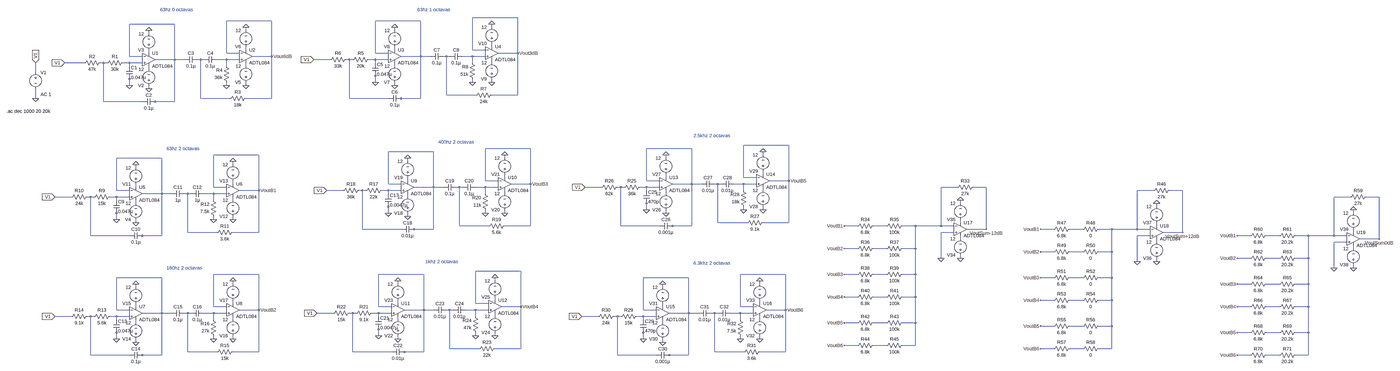
[diagram p0: schematic Ecualizador.asc, whole sheet]
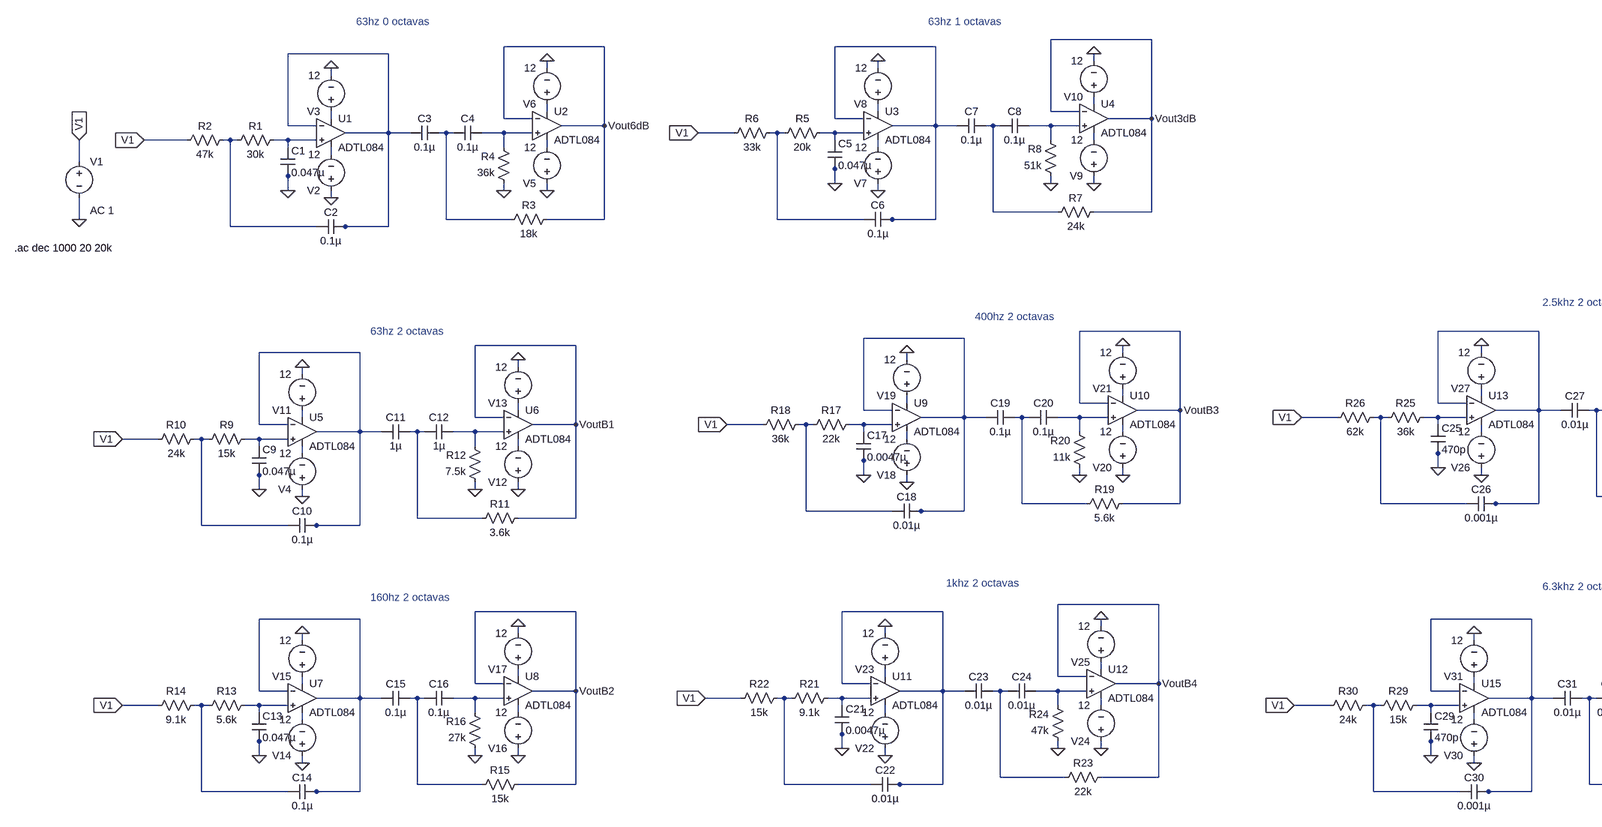
[diagram p1: schematic Ecualizador.asc, part, row 1 of 1, column 1 of 2]
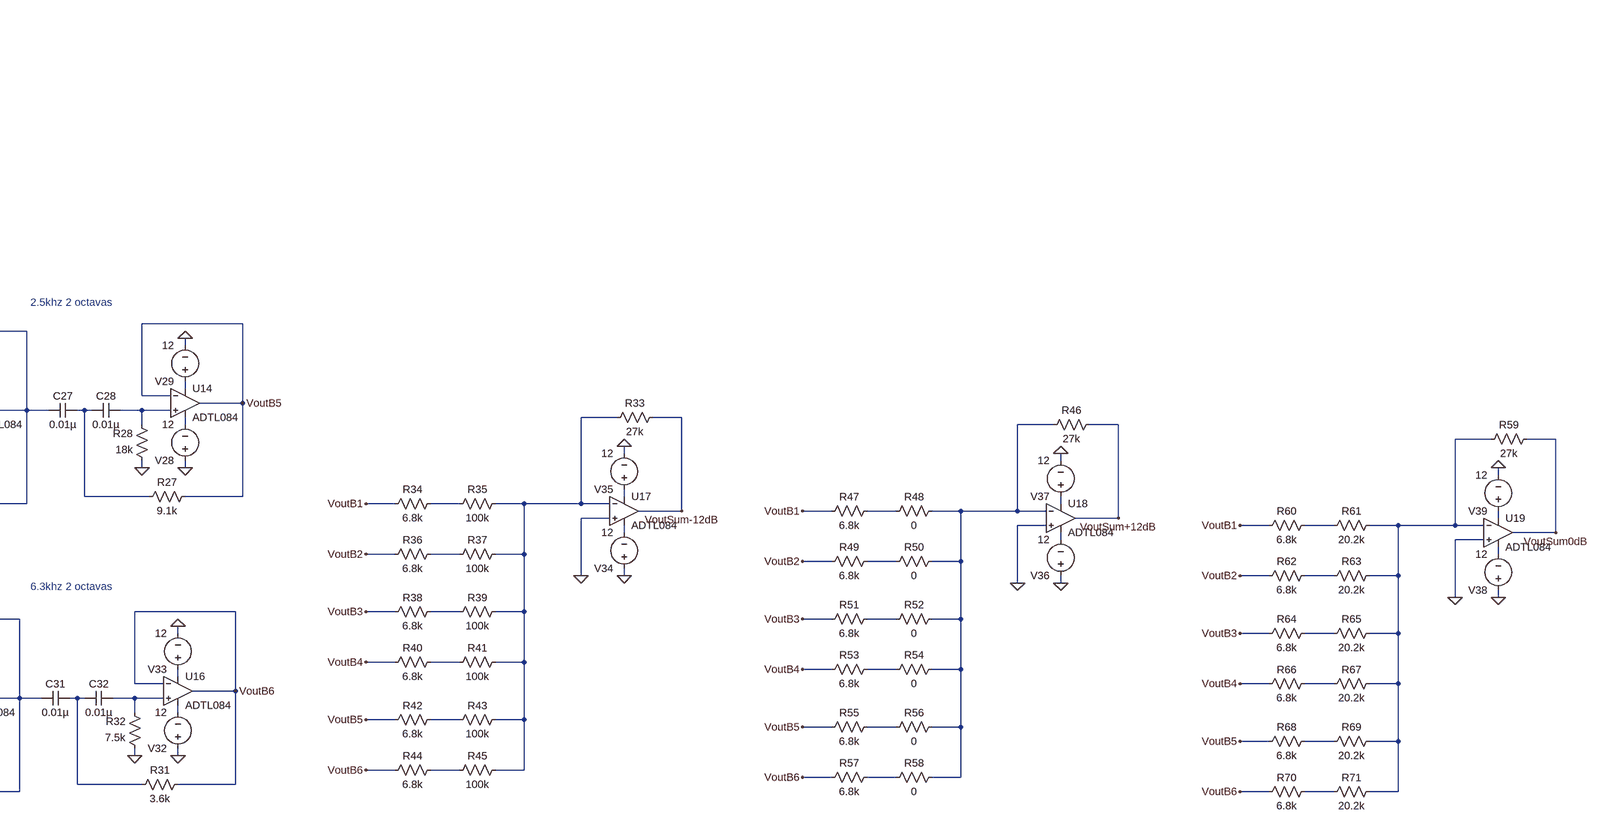
[diagram p2: schematic Ecualizador.asc, part, row 1 of 1, column 2 of 2]
Ecualizador.asc, the LTspice schematic file:
Version 4.1
SHEET 1 7452 4816
WIRE 1216 -80 992 -80
WIRE 0 -64 -224 -64
WIRE 736 -64 512 -64
WIRE -480 -48 -704 -48
WIRE 1088 -32 1088 -48
WIRE -128 -16 -128 -32
WIRE 608 -16 608 -32
WIRE -608 0 -608 -16
WIRE 1088 64 1088 48
WIRE -128 80 -128 64
WIRE 608 80 608 64
WIRE 992 80 992 -80
WIRE 1056 80 992 80
WIRE -608 96 -608 80
WIRE -224 96 -224 -64
WIRE -160 96 -224 96
WIRE 512 96 512 -64
WIRE 576 96 512 96
WIRE 1216 96 1216 -80
WIRE 1216 96 1120 96
WIRE -704 112 -704 -48
WIRE -640 112 -704 112
WIRE 0 112 0 -64
WIRE 0 112 -96 112
WIRE 736 112 736 -64
WIRE 736 112 640 112
WIRE 784 112 736 112
WIRE 864 112 848 112
WIRE 880 112 864 112
WIRE 992 112 944 112
WIRE 1056 112 992 112
WIRE -480 128 -480 -48
WIRE -480 128 -576 128
WIRE -432 128 -480 128
WIRE -352 128 -368 128
WIRE -336 128 -352 128
WIRE -224 128 -272 128
WIRE -160 128 -224 128
WIRE 288 128 208 128
WIRE 384 128 368 128
WIRE 400 128 384 128
WIRE 512 128 480 128
WIRE 576 128 512 128
WIRE -928 144 -1024 144
WIRE -832 144 -848 144
WIRE -816 144 -832 144
WIRE -704 144 -736 144
WIRE -640 144 -704 144
WIRE 512 144 512 128
WIRE 992 144 992 112
WIRE 1088 144 1088 128
WIRE -704 160 -704 144
WIRE -224 160 -224 128
WIRE -128 160 -128 144
WIRE 608 160 608 144
WIRE -608 176 -608 160
WIRE -1168 192 -1168 144
WIRE 512 208 512 192
WIRE -704 224 -704 208
WIRE 512 240 512 208
WIRE 992 240 992 224
WIRE 1088 240 1088 224
WIRE -704 256 -704 224
WIRE -224 256 -224 240
WIRE -128 256 -128 240
WIRE 608 256 608 240
WIRE -608 272 -608 256
WIRE 864 304 864 112
WIRE 1008 304 864 304
WIRE 1216 304 1216 96
WIRE 1216 304 1088 304
WIRE -1168 320 -1168 272
WIRE -352 320 -352 128
WIRE -208 320 -352 320
WIRE 0 320 0 112
WIRE 0 320 -128 320
WIRE 384 320 384 128
WIRE 576 320 384 320
WIRE 640 320 624 320
WIRE 736 320 736 112
WIRE 736 320 640 320
WIRE -832 336 -832 144
WIRE -640 336 -832 336
WIRE -576 336 -592 336
WIRE -480 336 -480 128
WIRE -480 336 -576 336
WIRE 2624 1344 2400 1344
WIRE 1280 1360 1056 1360
WIRE 2144 1360 1920 1360
WIRE 800 1376 576 1376
WIRE -64 1392 -288 1392
WIRE 2496 1392 2496 1376
WIRE -544 1408 -768 1408
WIRE 1152 1408 1152 1392
WIRE 2016 1408 2016 1392
WIRE 672 1424 672 1408
WIRE -192 1440 -192 1424
WIRE -672 1456 -672 1440
WIRE 2496 1488 2496 1472
WIRE 1152 1504 1152 1488
WIRE 2016 1504 2016 1488
WIRE 2400 1504 2400 1344
WIRE 2464 1504 2400 1504
WIRE 672 1520 672 1504
WIRE 1056 1520 1056 1360
WIRE 1120 1520 1056 1520
WIRE 1920 1520 1920 1360
WIRE 1984 1520 1920 1520
WIRE 2624 1520 2624 1344
WIRE 2624 1520 2528 1520
WIRE -192 1536 -192 1520
WIRE 576 1536 576 1376
WIRE 640 1536 576 1536
WIRE 1280 1536 1280 1360
WIRE 1280 1536 1184 1536
WIRE 2144 1536 2144 1360
WIRE 2144 1536 2048 1536
WIRE 2192 1536 2144 1536
WIRE 2272 1536 2256 1536
WIRE 2288 1536 2272 1536
WIRE 2400 1536 2352 1536
WIRE 2464 1536 2400 1536
WIRE -672 1552 -672 1536
WIRE -288 1552 -288 1392
WIRE -224 1552 -288 1552
WIRE 800 1552 800 1376
WIRE 800 1552 704 1552
WIRE 848 1552 800 1552
WIRE 928 1552 912 1552
WIRE 944 1552 928 1552
WIRE 1056 1552 1008 1552
WIRE 1120 1552 1056 1552
WIRE 1696 1552 1616 1552
WIRE 1792 1552 1776 1552
WIRE 1808 1552 1792 1552
WIRE 1920 1552 1888 1552
WIRE 1984 1552 1920 1552
WIRE 5056 1552 4976 1552
WIRE 5200 1552 5136 1552
WIRE -768 1568 -768 1408
WIRE -704 1568 -768 1568
WIRE -64 1568 -64 1392
WIRE -64 1568 -160 1568
WIRE 352 1568 272 1568
WIRE 448 1568 432 1568
WIRE 464 1568 448 1568
WIRE 576 1568 544 1568
WIRE 640 1568 576 1568
WIRE 1920 1568 1920 1552
WIRE 2400 1568 2400 1536
WIRE 2496 1568 2496 1552
WIRE 6160 1568 6080 1568
WIRE 6304 1568 6240 1568
WIRE -544 1584 -544 1408
WIRE -544 1584 -640 1584
WIRE -496 1584 -544 1584
WIRE -416 1584 -432 1584
WIRE -400 1584 -416 1584
WIRE -288 1584 -336 1584
WIRE -224 1584 -288 1584
WIRE 576 1584 576 1568
WIRE 1056 1584 1056 1552
WIRE 1152 1584 1152 1568
WIRE 2016 1584 2016 1568
WIRE -992 1600 -1072 1600
WIRE -896 1600 -912 1600
WIRE -880 1600 -896 1600
WIRE -768 1600 -800 1600
WIRE -704 1600 -768 1600
WIRE 672 1600 672 1584
WIRE 7216 1600 7136 1600
WIRE 7360 1600 7296 1600
WIRE -768 1616 -768 1600
WIRE -288 1616 -288 1584
WIRE -192 1616 -192 1600
WIRE -672 1632 -672 1616
WIRE 1920 1632 1920 1616
WIRE 5072 1632 5072 1616
WIRE 576 1648 576 1632
WIRE 6176 1648 6176 1632
WIRE 1920 1664 1920 1632
WIRE 2400 1664 2400 1648
WIRE 2496 1664 2496 1648
WIRE -768 1680 -768 1664
WIRE 576 1680 576 1648
WIRE 1056 1680 1056 1664
WIRE 1152 1680 1152 1664
WIRE 2016 1680 2016 1664
WIRE 7232 1680 7232 1664
WIRE 672 1696 672 1680
WIRE -768 1712 -768 1680
WIRE -288 1712 -288 1696
WIRE -192 1712 -192 1696
WIRE -672 1728 -672 1712
WIRE 2272 1728 2272 1536
WIRE 2416 1728 2272 1728
WIRE 2624 1728 2624 1520
WIRE 2624 1728 2496 1728
WIRE 5072 1728 5072 1712
WIRE 928 1744 928 1552
WIRE 1072 1744 928 1744
WIRE 1280 1744 1280 1536
WIRE 1280 1744 1152 1744
WIRE 1792 1744 1792 1552
WIRE 1984 1744 1792 1744
WIRE 2048 1744 2032 1744
WIRE 2144 1744 2144 1536
WIRE 2144 1744 2048 1744
WIRE 4512 1744 4448 1744
WIRE 4656 1744 4592 1744
WIRE 4800 1744 4736 1744
WIRE 4976 1744 4976 1552
WIRE 4976 1744 4800 1744
WIRE 5040 1744 4976 1744
WIRE 6176 1744 6176 1728
WIRE 448 1760 448 1568
WIRE 640 1760 448 1760
WIRE 704 1760 688 1760
WIRE 800 1760 800 1552
WIRE 800 1760 704 1760
WIRE 5200 1760 5200 1552
WIRE 5200 1760 5104 1760
WIRE 5616 1760 5552 1760
WIRE 5760 1760 5696 1760
WIRE 5904 1760 5840 1760
WIRE 6080 1760 6080 1568
WIRE 6080 1760 5904 1760
WIRE 6144 1760 6080 1760
WIRE -416 1776 -416 1584
WIRE -272 1776 -416 1776
WIRE -64 1776 -64 1568
WIRE -64 1776 -192 1776
WIRE 5040 1776 4976 1776
WIRE 6304 1776 6304 1568
WIRE 6304 1776 6208 1776
WIRE 7232 1776 7232 1760
WIRE -896 1792 -896 1600
WIRE -704 1792 -896 1792
WIRE -640 1792 -656 1792
WIRE -544 1792 -544 1584
WIRE -544 1792 -640 1792
WIRE 6144 1792 6080 1792
WIRE 6672 1792 6608 1792
WIRE 6816 1792 6752 1792
WIRE 6960 1792 6896 1792
WIRE 7136 1792 7136 1600
WIRE 7136 1792 6960 1792
WIRE 7200 1792 7136 1792
WIRE 5072 1808 5072 1792
WIRE 7360 1808 7360 1600
WIRE 7360 1808 7264 1808
WIRE 6176 1824 6176 1808
WIRE 7200 1824 7136 1824
WIRE 4512 1856 4448 1856
WIRE 4656 1856 4592 1856
WIRE 4800 1856 4800 1744
WIRE 4800 1856 4736 1856
WIRE 7232 1856 7232 1840
WIRE 5616 1872 5552 1872
WIRE 5760 1872 5696 1872
WIRE 5904 1872 5904 1760
WIRE 5904 1872 5840 1872
WIRE 4976 1904 4976 1776
WIRE 5072 1904 5072 1888
WIRE 6672 1904 6608 1904
WIRE 6816 1904 6752 1904
WIRE 6960 1904 6960 1792
WIRE 6960 1904 6896 1904
WIRE 6080 1920 6080 1792
WIRE 6176 1920 6176 1904
WIRE 7136 1952 7136 1824
WIRE 7232 1952 7232 1936
WIRE 1232 1968 1008 1968
WIRE -64 1984 -288 1984
WIRE 752 1984 528 1984
WIRE 2608 1984 2384 1984
WIRE 4512 1984 4448 1984
WIRE 4656 1984 4592 1984
WIRE 4800 1984 4800 1856
WIRE 4800 1984 4736 1984
WIRE -544 2000 -768 2000
WIRE 2128 2000 1904 2000
WIRE 5616 2000 5552 2000
WIRE 5760 2000 5696 2000
WIRE 5904 2000 5904 1872
WIRE 5904 2000 5840 2000
WIRE 1104 2016 1104 2000
WIRE -192 2032 -192 2016
WIRE 624 2032 624 2016
WIRE 2480 2032 2480 2016
WIRE 6672 2032 6608 2032
WIRE 6816 2032 6752 2032
WIRE 6960 2032 6960 1904
WIRE 6960 2032 6896 2032
WIRE -672 2048 -672 2032
WIRE 2000 2048 2000 2032
WIRE 4512 2096 4448 2096
WIRE 4656 2096 4592 2096
WIRE 4800 2096 4800 1984
WIRE 4800 2096 4736 2096
WIRE 1104 2112 1104 2096
WIRE 5616 2112 5552 2112
WIRE 5760 2112 5696 2112
WIRE 5904 2112 5904 2000
WIRE 5904 2112 5840 2112
WIRE -192 2128 -192 2112
WIRE 624 2128 624 2112
WIRE 1008 2128 1008 1968
WIRE 1072 2128 1008 2128
WIRE 2480 2128 2480 2112
WIRE -672 2144 -672 2128
WIRE -288 2144 -288 1984
WIRE -224 2144 -288 2144
WIRE 528 2144 528 1984
WIRE 592 2144 528 2144
WIRE 1232 2144 1232 1968
WIRE 1232 2144 1136 2144
WIRE 2000 2144 2000 2128
WIRE 2384 2144 2384 1984
WIRE 2448 2144 2384 2144
WIRE 6672 2144 6608 2144
WIRE 6816 2144 6752 2144
WIRE 6960 2144 6960 2032
WIRE 6960 2144 6896 2144
WIRE -768 2160 -768 2000
WIRE -704 2160 -768 2160
WIRE -64 2160 -64 1984
WIRE -64 2160 -160 2160
WIRE 752 2160 752 1984
WIRE 752 2160 656 2160
WIRE 800 2160 752 2160
WIRE 880 2160 864 2160
WIRE 896 2160 880 2160
WIRE 1008 2160 960 2160
WIRE 1072 2160 1008 2160
WIRE 1904 2160 1904 2000
WIRE 1968 2160 1904 2160
WIRE 2608 2160 2608 1984
WIRE 2608 2160 2512 2160
WIRE -544 2176 -544 2000
WIRE -544 2176 -640 2176
WIRE -496 2176 -544 2176
WIRE -416 2176 -432 2176
WIRE -400 2176 -416 2176
WIRE -288 2176 -336 2176
WIRE -224 2176 -288 2176
WIRE 304 2176 224 2176
WIRE 400 2176 384 2176
WIRE 416 2176 400 2176
WIRE 528 2176 496 2176
WIRE 592 2176 528 2176
WIRE 2128 2176 2128 2000
WIRE 2128 2176 2032 2176
WIRE 2176 2176 2128 2176
WIRE 2256 2176 2240 2176
WIRE 2272 2176 2256 2176
WIRE 2384 2176 2336 2176
WIRE 2448 2176 2384 2176
WIRE -992 2192 -1072 2192
WIRE -896 2192 -912 2192
WIRE -880 2192 -896 2192
WIRE -768 2192 -800 2192
WIRE -704 2192 -768 2192
WIRE 528 2192 528 2176
WIRE 1008 2192 1008 2160
WIRE 1104 2192 1104 2176
WIRE 1680 2192 1600 2192
WIRE 1776 2192 1760 2192
WIRE 1792 2192 1776 2192
WIRE 1904 2192 1872 2192
WIRE 1968 2192 1904 2192
WIRE -768 2208 -768 2192
WIRE -288 2208 -288 2176
WIRE -192 2208 -192 2192
WIRE 624 2208 624 2192
WIRE 1904 2208 1904 2192
WIRE 2384 2208 2384 2176
WIRE 2480 2208 2480 2192
WIRE -672 2224 -672 2208
WIRE 2000 2224 2000 2208
WIRE 4512 2224 4448 2224
WIRE 4656 2224 4592 2224
WIRE 4800 2224 4800 2096
WIRE 4800 2224 4736 2224
WIRE 5616 2240 5552 2240
WIRE 5760 2240 5696 2240
WIRE 5904 2240 5904 2112
WIRE 5904 2240 5840 2240
WIRE 528 2256 528 2240
WIRE -768 2272 -768 2256
WIRE 1904 2272 1904 2256
WIRE 6672 2272 6608 2272
WIRE 6816 2272 6752 2272
WIRE 6960 2272 6960 2144
WIRE 6960 2272 6896 2272
WIRE 528 2288 528 2256
WIRE 1008 2288 1008 2272
WIRE 1104 2288 1104 2272
WIRE -768 2304 -768 2272
WIRE -288 2304 -288 2288
WIRE -192 2304 -192 2288
WIRE 624 2304 624 2288
WIRE 1904 2304 1904 2272
WIRE 2384 2304 2384 2288
WIRE 2480 2304 2480 2288
WIRE -672 2320 -672 2304
WIRE 2000 2320 2000 2304
WIRE 4512 2336 4448 2336
WIRE 4656 2336 4592 2336
WIRE 4800 2336 4800 2224
WIRE 4800 2336 4736 2336
WIRE 880 2352 880 2160
WIRE 1024 2352 880 2352
WIRE 1232 2352 1232 2144
WIRE 1232 2352 1104 2352
WIRE 5616 2352 5552 2352
WIRE 5760 2352 5696 2352
WIRE 5904 2352 5904 2240
WIRE 5904 2352 5840 2352
WIRE -416 2368 -416 2176
WIRE -272 2368 -416 2368
WIRE -64 2368 -64 2160
WIRE -64 2368 -192 2368
WIRE 400 2368 400 2176
WIRE 592 2368 400 2368
WIRE 656 2368 640 2368
WIRE 752 2368 752 2160
WIRE 752 2368 656 2368
WIRE 2256 2368 2256 2176
WIRE 2400 2368 2256 2368
WIRE 2608 2368 2608 2160
WIRE 2608 2368 2480 2368
WIRE -896 2384 -896 2192
WIRE -704 2384 -896 2384
WIRE -640 2384 -656 2384
WIRE -544 2384 -544 2176
WIRE -544 2384 -640 2384
WIRE 1776 2384 1776 2192
WIRE 1968 2384 1776 2384
WIRE 2032 2384 2016 2384
WIRE 2128 2384 2128 2176
WIRE 2128 2384 2032 2384
WIRE 6672 2384 6608 2384
WIRE 6816 2384 6752 2384
WIRE 6960 2384 6960 2272
WIRE 6960 2384 6896 2384
FLAG -704 256 0
FLAG -1168 320 0
FLAG -608 272 0
FLAG -608 -16 0
FLAG -224 256 0
FLAG -128 256 0
FLAG -128 -32 0
FLAG 0 112 Vout6dB
FLAG 512 240 0
FLAG 608 256 0
FLAG 608 -32 0
FLAG 992 240 0
FLAG 1088 240 0
FLAG 1088 -48 0
FLAG 1216 96 Vout3dB
FLAG -1168 144 V1
IOPIN -1168 144 In
FLAG -1024 144 V1
IOPIN -1024 144 In
FLAG 208 128 V1
IOPIN 208 128 In
FLAG -768 1712 0
FLAG -672 1728 0
FLAG -672 1440 0
FLAG -288 1712 0
FLAG -192 1712 0
FLAG -192 1424 0
FLAG -64 1568 VoutB1
FLAG -1072 1600 V1
IOPIN -1072 1600 In
FLAG -768 2304 0
FLAG -672 2320 0
FLAG -672 2032 0
FLAG -288 2304 0
FLAG -192 2304 0
FLAG -192 2016 0
FLAG -64 2160 VoutB2
FLAG -1072 2192 V1
IOPIN -1072 2192 In
FLAG 576 1680 0
FLAG 672 1696 0
FLAG 672 1408 0
FLAG 1056 1680 0
FLAG 1152 1680 0
FLAG 1152 1392 0
FLAG 1280 1536 VoutB3
FLAG 272 1568 V1
IOPIN 272 1568 In
FLAG 528 2288 0
FLAG 624 2304 0
FLAG 624 2016 0
FLAG 1008 2288 0
FLAG 1104 2288 0
FLAG 1104 2000 0
FLAG 1232 2144 VoutB4
FLAG 224 2176 V1
IOPIN 224 2176 In
FLAG 1920 1664 0
FLAG 2016 1680 0
FLAG 2016 1392 0
FLAG 2400 1664 0
FLAG 2496 1664 0
FLAG 2496 1376 0
FLAG 2624 1520 VoutB5
FLAG 1616 1552 V1
IOPIN 1616 1552 In
FLAG 1904 2304 0
FLAG 2000 2320 0
FLAG 2000 2032 0
FLAG 2384 2304 0
FLAG 2480 2304 0
FLAG 2480 2016 0
FLAG 2608 2160 VoutB6
FLAG 1600 2192 V1
IOPIN 1600 2192 In
FLAG 5072 1904 0
FLAG 5072 1616 0
FLAG 5200 1760 VoutSum-12dB
FLAG 4976 1904 0
FLAG 4448 1744 VoutB1
FLAG 4448 1856 VoutB2
FLAG 4448 1984 VoutB3
FLAG 4448 2096 VoutB4
FLAG 4448 2224 VoutB5
FLAG 4448 2336 VoutB6
FLAG 6176 1920 0
FLAG 6176 1632 0
FLAG 6304 1776 VoutSum+12dB
FLAG 6080 1920 0
FLAG 5552 1760 VoutB1
FLAG 5552 1872 VoutB2
FLAG 5552 2000 VoutB3
FLAG 5552 2112 VoutB4
FLAG 5552 2240 VoutB5
FLAG 5552 2352 VoutB6
FLAG 7232 1952 0
FLAG 7232 1664 0
FLAG 7360 1808 VoutSum0dB
FLAG 7136 1952 0
FLAG 6608 1792 VoutB1
FLAG 6608 1904 VoutB2
FLAG 6608 2032 VoutB3
FLAG 6608 2144 VoutB4
FLAG 6608 2272 VoutB5
FLAG 6608 2384 VoutB6
SYMBOL OpAmps\\ADTL084 -608 64 R0
SYMATTR InstName U1
SYMBOL cap -720 160 R0
SYMATTR InstName C1
SYMATTR Value 0.047µ
SYMBOL cap -576 320 R90
WINDOW 0 0 32 VBottom 2
WINDOW 3 32 32 VTop 2
SYMATTR InstName C2
SYMATTR Value 0.1µ
SYMBOL res -720 128 R90
WINDOW 0 0 56 VBottom 2
WINDOW 3 32 56 VTop 2
SYMATTR InstName R1
SYMATTR Value 30k
SYMBOL res -832 128 R90
WINDOW 0 0 56 VBottom 2
WINDOW 3 32 56 VTop 2
SYMATTR InstName R2
SYMATTR Value 47k
SYMBOL voltage -1168 176 R0
WINDOW 123 24 124 Left 2
WINDOW 39 0 0 Left 0
SYMATTR Value2 AC 1
SYMATTR InstName V1
SYMATTR Value ""
SYMBOL voltage -608 272 R180
WINDOW 123 0 0 Left 0
WINDOW 39 0 0 Left 0
SYMATTR InstName V2
SYMATTR Value 12
SYMBOL voltage -608 96 R180
WINDOW 123 0 0 Left 0
WINDOW 39 0 0 Left 0
SYMATTR InstName V3
SYMATTR Value 12
SYMBOL OpAmps\\ADTL084 -128 48 R0
SYMATTR InstName U2
SYMBOL cap -368 112 R90
WINDOW 0 0 32 VBottom 2
WINDOW 3 32 32 VTop 2
SYMATTR InstName C3
SYMATTR Value 0.1µ
SYMBOL cap -272 112 R90
WINDOW 0 0 32 VBottom 2
WINDOW 3 32 32 VTop 2
SYMATTR InstName C4
SYMATTR Value 0.1µ
SYMBOL res -112 304 R90
WINDOW 0 0 56 VBottom 2
WINDOW 3 32 56 VTop 2
SYMATTR InstName R3
SYMATTR Value 18k
SYMBOL res -208 256 R180
WINDOW 0 36 76 Left 2
WINDOW 3 36 40 Left 2
SYMATTR InstName R4
SYMATTR Value 36k
SYMBOL voltage -128 256 R180
WINDOW 123 0 0 Left 0
WINDOW 39 0 0 Left 0
SYMATTR InstName V5
SYMATTR Value 12
SYMBOL voltage -128 80 R180
WINDOW 123 0 0 Left 0
WINDOW 39 0 0 Left 0
SYMATTR InstName V6
SYMATTR Value 12
SYMBOL OpAmps\\ADTL084 608 48 R0
SYMATTR InstName U3
SYMBOL cap 496 144 R0
SYMATTR InstName C5
SYMATTR Value 0.047µ
SYMBOL cap 640 304 R90
WINDOW 0 0 32 VBottom 2
WINDOW 3 32 32 VTop 2
SYMATTR InstName C6
SYMATTR Value 0.1µ
SYMBOL res 496 112 R90
WINDOW 0 0 56 VBottom 2
WINDOW 3 32 56 VTop 2
SYMATTR InstName R5
SYMATTR Value 20k
SYMBOL res 384 112 R90
WINDOW 0 0 56 VBottom 2
WINDOW 3 32 56 VTop 2
SYMATTR InstName R6
SYMATTR Value 33k
SYMBOL voltage 608 256 R180
WINDOW 123 0 0 Left 0
WINDOW 39 0 0 Left 0
SYMATTR InstName V7
SYMATTR Value 12
SYMBOL voltage 608 80 R180
WINDOW 123 0 0 Left 0
WINDOW 39 0 0 Left 0
SYMATTR InstName V8
SYMATTR Value 12
SYMBOL OpAmps\\ADTL084 1088 32 R0
SYMATTR InstName U4
SYMBOL cap 848 96 R90
WINDOW 0 0 32 VBottom 2
WINDOW 3 32 32 VTop 2
SYMATTR InstName C7
SYMATTR Value 0.1µ
SYMBOL cap 944 96 R90
WINDOW 0 0 32 VBottom 2
WINDOW 3 32 32 VTop 2
SYMATTR InstName C8
SYMATTR Value 0.1µ
SYMBOL res 1104 288 R90
WINDOW 0 0 56 VBottom 2
WINDOW 3 32 56 VTop 2
SYMATTR InstName R7
SYMATTR Value 24k
SYMBOL res 1008 240 R180
WINDOW 0 36 76 Left 2
WINDOW 3 36 40 Left 2
SYMATTR InstName R8
SYMATTR Value 51k
SYMBOL voltage 1088 240 R180
WINDOW 123 0 0 Left 0
WINDOW 39 0 0 Left 0
SYMATTR InstName V9
SYMATTR Value 12
SYMBOL voltage 1088 64 R180
WINDOW 123 0 0 Left 0
WINDOW 39 0 0 Left 0
SYMATTR InstName V10
SYMATTR Value 12
SYMBOL OpAmps\\ADTL084 -672 1520 R0
SYMATTR InstName U5
SYMBOL cap -784 1616 R0
SYMATTR InstName C9
SYMATTR Value 0.047µ
SYMBOL cap -640 1776 R90
WINDOW 0 0 32 VBottom 2
WINDOW 3 32 32 VTop 2
SYMATTR InstName C10
SYMATTR Value 0.1µ
SYMBOL res -784 1584 R90
WINDOW 0 0 56 VBottom 2
WINDOW 3 32 56 VTop 2
SYMATTR InstName R9
SYMATTR Value 15k
SYMBOL res -896 1584 R90
WINDOW 0 0 56 VBottom 2
WINDOW 3 32 56 VTop 2
SYMATTR InstName R10
SYMATTR Value 24k
SYMBOL voltage -672 1728 R180
WINDOW 123 0 0 Left 0
WINDOW 39 0 0 Left 0
SYMATTR InstName V4
SYMATTR Value 12
SYMBOL voltage -672 1552 R180
WINDOW 123 0 0 Left 0
WINDOW 39 0 0 Left 0
SYMATTR InstName V11
SYMATTR Value 12
SYMBOL OpAmps\\ADTL084 -192 1504 R0
SYMATTR InstName U6
SYMBOL cap -432 1568 R90
WINDOW 0 0 32 VBottom 2
WINDOW 3 32 32 VTop 2
SYMATTR InstName C11
SYMATTR Value 1µ
SYMBOL cap -336 1568 R90
WINDOW 0 0 32 VBottom 2
WINDOW 3 32 32 VTop 2
SYMATTR InstName C12
SYMATTR Value 1µ
SYMBOL res -176 1760 R90
WINDOW 0 0 56 VBottom 2
WINDOW 3 32 56 VTop 2
SYMATTR InstName R11
SYMATTR Value 3.6k
SYMBOL res -272 1712 R180
WINDOW 0 36 76 Left 2
WINDOW 3 36 40 Left 2
SYMATTR InstName R12
SYMATTR Value 7.5k
SYMBOL voltage -192 1712 R180
WINDOW 123 0 0 Left 0
WINDOW 39 0 0 Left 0
SYMATTR InstName V12
SYMATTR Value 12
SYMBOL voltage -192 1536 R180
WINDOW 123 0 0 Left 0
WINDOW 39 0 0 Left 0
SYMATTR InstName V13
SYMATTR Value 12
SYMBOL OpAmps\\ADTL084 -672 2112 R0
SYMATTR InstName U7
SYMBOL cap -784 2208 R0
SYMATTR InstName C13
SYMATTR Value 0.047µ
SYMBOL cap -640 2368 R90
WINDOW 0 0 32 VBottom 2
WINDOW 3 32 32 VTop 2
SYMATTR InstName C14
SYMATTR Value 0.1µ
SYMBOL res -784 2176 R90
WINDOW 0 0 56 VBottom 2
WINDOW 3 32 56 VTop 2
SYMATTR InstName R13
SYMATTR Value 5.6k
SYMBOL res -896 2176 R90
WINDOW 0 0 56 VBottom 2
WINDOW 3 32 56 VTop 2
SYMATTR InstName R14
SYMATTR Value 9.1k
SYMBOL voltage -672 2320 R180
WINDOW 123 0 0 Left 0
WINDOW 39 0 0 Left 0
SYMATTR InstName V14
SYMATTR Value 12
SYMBOL voltage -672 2144 R180
WINDOW 123 0 0 Left 0
WINDOW 39 0 0 Left 0
SYMATTR InstName V15
SYMATTR Value 12
SYMBOL OpAmps\\ADTL084 -192 2096 R0
SYMATTR InstName U8
SYMBOL cap -432 2160 R90
WINDOW 0 0 32 VBottom 2
WINDOW 3 32 32 VTop 2
SYMATTR InstName C15
SYMATTR Value 0.1µ
SYMBOL cap -336 2160 R90
WINDOW 0 0 32 VBottom 2
WINDOW 3 32 32 VTop 2
SYMATTR InstName C16
SYMATTR Value 0.1µ
SYMBOL res -176 2352 R90
WINDOW 0 0 56 VBottom 2
WINDOW 3 32 56 VTop 2
SYMATTR InstName R15
SYMATTR Value 15k
SYMBOL res -272 2304 R180
WINDOW 0 36 76 Left 2
WINDOW 3 36 40 Left 2
SYMATTR InstName R16
SYMATTR Value 27k
SYMBOL voltage -192 2304 R180
WINDOW 123 0 0 Left 0
WINDOW 39 0 0 Left 0
SYMATTR InstName V16
SYMATTR Value 12
SYMBOL voltage -192 2128 R180
WINDOW 123 0 0 Left 0
WINDOW 39 0 0 Left 0
SYMATTR InstName V17
SYMATTR Value 12
SYMBOL OpAmps\\ADTL084 672 1488 R0
SYMATTR InstName U9
SYMBOL cap 560 1584 R0
SYMATTR InstName C17
SYMATTR Value 0.0047µ
SYMBOL cap 704 1744 R90
WINDOW 0 0 32 VBottom 2
WINDOW 3 32 32 VTop 2
SYMATTR InstName C18
SYMATTR Value 0.01µ
SYMBOL res 560 1552 R90
WINDOW 0 0 56 VBottom 2
WINDOW 3 32 56 VTop 2
SYMATTR InstName R17
SYMATTR Value 22k
SYMBOL res 448 1552 R90
WINDOW 0 0 56 VBottom 2
WINDOW 3 32 56 VTop 2
SYMATTR InstName R18
SYMATTR Value 36k
SYMBOL voltage 672 1696 R180
WINDOW 123 0 0 Left 0
WINDOW 39 0 0 Left 0
SYMATTR InstName V18
SYMATTR Value 12
SYMBOL voltage 672 1520 R180
WINDOW 123 0 0 Left 0
WINDOW 39 0 0 Left 0
SYMATTR InstName V19
SYMATTR Value 12
SYMBOL OpAmps\\ADTL084 1152 1472 R0
SYMATTR InstName U10
SYMBOL cap 912 1536 R90
WINDOW 0 0 32 VBottom 2
WINDOW 3 32 32 VTop 2
SYMATTR InstName C19
SYMATTR Value 0.1µ
SYMBOL cap 1008 1536 R90
WINDOW 0 0 32 VBottom 2
WINDOW 3 32 32 VTop 2
SYMATTR InstName C20
SYMATTR Value 0.1µ
SYMBOL res 1168 1728 R90
WINDOW 0 0 56 VBottom 2
WINDOW 3 32 56 VTop 2
SYMATTR InstName R19
SYMATTR Value 5.6k
SYMBOL res 1072 1680 R180
WINDOW 0 36 76 Left 2
WINDOW 3 36 40 Left 2
SYMATTR InstName R20
SYMATTR Value 11k
SYMBOL voltage 1152 1680 R180
WINDOW 123 0 0 Left 0
WINDOW 39 0 0 Left 0
SYMATTR InstName V20
SYMATTR Value 12
SYMBOL voltage 1152 1504 R180
WINDOW 123 0 0 Left 0
WINDOW 39 0 0 Left 0
SYMATTR InstName V21
SYMATTR Value 12
SYMBOL OpAmps\\ADTL084 624 2096 R0
SYMATTR InstName U11
SYMBOL cap 512 2192 R0
SYMATTR InstName C21
SYMATTR Value 0.0047µ
SYMBOL cap 656 2352 R90
WINDOW 0 0 32 VBottom 2
WINDOW 3 32 32 VTop 2
SYMATTR InstName C22
SYMATTR Value 0.01µ
SYMBOL res 512 2160 R90
WINDOW 0 0 56 VBottom 2
WINDOW 3 32 56 VTop 2
SYMATTR InstName R21
SYMATTR Value 9.1k
SYMBOL res 400 2160 R90
WINDOW 0 0 56 VBottom 2
WINDOW 3 32 56 VTop 2
SYMATTR InstName R22
SYMATTR Value 15k
SYMBOL voltage 624 2304 R180
WINDOW 123 0 0 Left 0
WINDOW 39 0 0 Left 0
SYMATTR InstName V22
SYMATTR Value 12
SYMBOL voltage 624 2128 R180
WINDOW 123 0 0 Left 0
WINDOW 39 0 0 Left 0
SYMATTR InstName V23
SYMATTR Value 12
SYMBOL OpAmps\\ADTL084 1104 2080 R0
SYMATTR InstName U12
SYMBOL cap 864 2144 R90
WINDOW 0 0 32 VBottom 2
WINDOW 3 32 32 VTop 2
SYMATTR InstName C23
SYMATTR Value 0.01µ
SYMBOL cap 960 2144 R90
WINDOW 0 0 32 VBottom 2
WINDOW 3 32 32 VTop 2
SYMATTR InstName C24
SYMATTR Value 0.01µ
SYMBOL res 1120 2336 R90
WINDOW 0 0 56 VBottom 2
WINDOW 3 32 56 VTop 2
SYMATTR InstName R23
SYMATTR Value 22k
SYMBOL res 1024 2288 R180
WINDOW 0 36 76 Left 2
WINDOW 3 36 40 Left 2
SYMATTR InstName R24
SYMATTR Value 47k
SYMBOL voltage 1104 2288 R180
WINDOW 123 0 0 Left 0
WINDOW 39 0 0 Left 0
SYMATTR InstName V24
SYMATTR Value 12
SYMBOL voltage 1104 2112 R180
WINDOW 123 0 0 Left 0
WINDOW 39 0 0 Left 0
SYMATTR InstName V25
SYMATTR Value 12
SYMBOL OpAmps\\ADTL084 2016 1472 R0
SYMATTR InstName U13
SYMBOL cap 1904 1568 R0
SYMATTR InstName C25
SYMATTR Value 470p
SYMBOL cap 2048 1728 R90
WINDOW 0 0 32 VBottom 2
WINDOW 3 32 32 VTop 2
SYMATTR InstName C26
SYMATTR Value 0.001µ
SYMBOL res 1904 1536 R90
WINDOW 0 0 56 VBottom 2
WINDOW 3 32 56 VTop 2
SYMATTR InstName R25
SYMATTR Value 36k
SYMBOL res 1792 1536 R90
WINDOW 0 0 56 VBottom 2
WINDOW 3 32 56 VTop 2
SYMATTR InstName R26
SYMATTR Value 62k
SYMBOL voltage 2016 1680 R180
WINDOW 123 0 0 Left 0
WINDOW 39 0 0 Left 0
SYMATTR InstName V26
SYMATTR Value 12
SYMBOL voltage 2016 1504 R180
WINDOW 123 0 0 Left 0
WINDOW 39 0 0 Left 0
SYMATTR InstName V27
SYMATTR Value 12
SYMBOL OpAmps\\ADTL084 2496 1456 R0
SYMATTR InstName U14
SYMBOL cap 2256 1520 R90
WINDOW 0 0 32 VBottom 2
WINDOW 3 32 32 VTop 2
SYMATTR InstName C27
SYMATTR Value 0.01µ
SYMBOL cap 2352 1520 R90
WINDOW 0 0 32 VBottom 2
WINDOW 3 32 32 VTop 2
SYMATTR InstName C28
SYMATTR Value 0.01µ
SYMBOL res 2512 1712 R90
WINDOW 0 0 56 VBottom 2
WINDOW 3 32 56 VTop 2
SYMATTR InstName R27
SYMATTR Value 9.1k
SYMBOL res 2416 1664 R180
WINDOW 0 36 76 Left 2
WINDOW 3 36 40 Left 2
SYMATTR InstName R28
SYMATTR Value 18k
SYMBOL voltage 2496 1664 R180
WINDOW 123 0 0 Left 0
WINDOW 39 0 0 Left 0
SYMATTR InstName V28
SYMATTR Value 12
SYMBOL voltage 2496 1488 R180
WINDOW 123 0 0 Left 0
WINDOW 39 0 0 Left 0
SYMATTR InstName V29
SYMATTR Value 12
SYMBOL OpAmps\\ADTL084 2000 2112 R0
SYMATTR InstName U15
SYMBOL cap 1888 2208 R0
SYMATTR InstName C29
SYMATTR Value 470p
SYMBOL cap 2032 2368 R90
WINDOW 0 0 32 VBottom 2
WINDOW 3 32 32 VTop 2
SYMATTR InstName C30
SYMATTR Value 0.001µ
SYMBOL res 1888 2176 R90
WINDOW 0 0 56 VBottom 2
WINDOW 3 32 56 VTop 2
SYMATTR InstName R29
SYMATTR Value 15k
SYMBOL res 1776 2176 R90
WINDOW 0 0 56 VBottom 2
WINDOW 3 32 56 VTop 2
SYMATTR InstName R30
SYMATTR Value 24k
SYMBOL voltage 2000 2320 R180
WINDOW 123 0 0 Left 0
WINDOW 39 0 0 Left 0
SYMATTR InstName V30
SYMATTR Value 12
SYMBOL voltage 2000 2144 R180
WINDOW 123 0 0 Left 0
WINDOW 39 0 0 Left 0
SYMATTR InstName V31
SYMATTR Value 12
SYMBOL OpAmps\\ADTL084 2480 2096 R0
SYMATTR InstName U16
SYMBOL cap 2240 2160 R90
WINDOW 0 0 32 VBottom 2
WINDOW 3 32 32 VTop 2
SYMATTR InstName C31
SYMATTR Value 0.01µ
SYMBOL cap 2336 2160 R90
WINDOW 0 0 32 VBottom 2
WINDOW 3 32 32 VTop 2
SYMATTR InstName C32
SYMATTR Value 0.01µ
SYMBOL res 2496 2352 R90
WINDOW 0 0 56 VBottom 2
WINDOW 3 32 56 VTop 2
SYMATTR InstName R31
SYMATTR Value 3.6k
SYMBOL res 2400 2304 R180
WINDOW 0 36 76 Left 2
WINDOW 3 36 40 Left 2
SYMATTR InstName R32
SYMATTR Value 7.5k
SYMBOL voltage 2480 2304 R180
WINDOW 123 0 0 Left 0
WINDOW 39 0 0 Left 0
SYMATTR InstName V32
SYMATTR Value 12
SYMBOL voltage 2480 2128 R180
WINDOW 123 0 0 Left 0
WINDOW 39 0 0 Left 0
SYMATTR InstName V33
SYMATTR Value 12
SYMBOL OpAmps\\ADTL084 5072 1696 R0
SYMATTR InstName U17
SYMBOL voltage 5072 1904 R180
WINDOW 123 0 0 Left 0
WINDOW 39 0 0 Left 0
SYMATTR InstName V34
SYMATTR Value 12
SYMBOL voltage 5072 1728 R180
WINDOW 123 0 0 Left 0
WINDOW 39 0 0 Left 0
SYMATTR InstName V35
SYMATTR Value 12
SYMBOL res 5152 1536 R90
WINDOW 0 0 56 VBottom 2
WINDOW 3 32 56 VTop 2
SYMATTR InstName R33
SYMATTR Value 27k
SYMBOL res 4608 1728 R90
WINDOW 0 0 56 VBottom 2
WINDOW 3 32 56 VTop 2
SYMATTR InstName R34
SYMATTR Value 6.8k
SYMBOL res 4752 1728 R90
WINDOW 0 0 56 VBottom 2
WINDOW 3 32 56 VTop 2
SYMATTR InstName R35
SYMATTR Value 100k
SYMBOL res 4608 1840 R90
WINDOW 0 0 56 VBottom 2
WINDOW 3 32 56 VTop 2
SYMATTR InstName R36
SYMATTR Value 6.8k
SYMBOL res 4752 1840 R90
WINDOW 0 0 56 VBottom 2
WINDOW 3 32 56 VTop 2
SYMATTR InstName R37
SYMATTR Value 100k
SYMBOL res 4608 1968 R90
WINDOW 0 0 56 VBottom 2
WINDOW 3 32 56 VTop 2
SYMATTR InstName R38
SYMATTR Value 6.8k
SYMBOL res 4752 1968 R90
WINDOW 0 0 56 VBottom 2
WINDOW 3 32 56 VTop 2
SYMATTR InstName R39
SYMATTR Value 100k
SYMBOL res 4608 2080 R90
WINDOW 0 0 56 VBottom 2
WINDOW 3 32 56 VTop 2
SYMATTR InstName R40
SYMATTR Value 6.8k
SYMBOL res 4752 2080 R90
WINDOW 0 0 56 VBottom 2
WINDOW 3 32 56 VTop 2
SYMATTR InstName R41
SYMATTR Value 100k
SYMBOL res 4608 2208 R90
WINDOW 0 0 56 VBottom 2
WINDOW 3 32 56 VTop 2
SYMATTR InstName R42
SYMATTR Value 6.8k
SYMBOL res 4752 2208 R90
WINDOW 0 0 56 VBottom 2
WINDOW 3 32 56 VTop 2
SYMATTR InstName R43
SYMATTR Value 100k
SYMBOL res 4608 2320 R90
WINDOW 0 0 56 VBottom 2
WINDOW 3 32 56 VTop 2
SYMATTR InstName R44
SYMATTR Value 6.8k
SYMBOL res 4752 2320 R90
WINDOW 0 0 56 VBottom 2
WINDOW 3 32 56 VTop 2
SYMATTR InstName R45
SYMATTR Value 100k
SYMBOL OpAmps\\ADTL084 6176 1712 R0
SYMATTR InstName U18
SYMBOL voltage 6176 1920 R180
WINDOW 123 0 0 Left 0
WINDOW 39 0 0 Left 0
SYMATTR InstName V36
SYMATTR Value 12
SYMBOL voltage 6176 1744 R180
WINDOW 123 0 0 Left 0
WINDOW 39 0 0 Left 0
SYMATTR InstName V37
SYMATTR Value 12
SYMBOL res 6256 1552 R90
WINDOW 0 0 56 VBottom 2
WINDOW 3 32 56 VTop 2
SYMATTR InstName R46
SYMATTR Value 27k
SYMBOL res 5712 1744 R90
WINDOW 0 0 56 VBottom 2
WINDOW 3 32 56 VTop 2
SYMATTR InstName R47
SYMATTR Value 6.8k
SYMBOL res 5856 1744 R90
WINDOW 0 0 56 VBottom 2
WINDOW 3 32 56 VTop 2
SYMATTR InstName R48
SYMATTR Value 0
SYMBOL res 5712 1856 R90
WINDOW 0 0 56 VBottom 2
WINDOW 3 32 56 VTop 2
SYMATTR InstName R49
SYMATTR Value 6.8k
SYMBOL res 5856 1856 R90
WINDOW 0 0 56 VBottom 2
WINDOW 3 32 56 VTop 2
SYMATTR InstName R50
SYMATTR Value 0
SYMBOL res 5712 1984 R90
WINDOW 0 0 56 VBottom 2
WINDOW 3 32 56 VTop 2
SYMATTR InstName R51
SYMATTR Value 6.8k
SYMBOL res 5856 1984 R90
WINDOW 0 0 56 VBottom 2
WINDOW 3 32 56 VTop 2
SYMATTR InstName R52
SYMATTR Value 0
SYMBOL res 5712 2096 R90
WINDOW 0 0 56 VBottom 2
WINDOW 3 32 56 VTop 2
SYMATTR InstName R53
SYMATTR Value 6.8k
SYMBOL res 5856 2096 R90
WINDOW 0 0 56 VBottom 2
WINDOW 3 32 56 VTop 2
SYMATTR InstName R54
SYMATTR Value 0
SYMBOL res 5712 2224 R90
WINDOW 0 0 56 VBottom 2
WINDOW 3 32 56 VTop 2
SYMATTR InstName R55
SYMATTR Value 6.8k
SYMBOL res 5856 2224 R90
WINDOW 0 0 56 VBottom 2
WINDOW 3 32 56 VTop 2
SYMATTR InstName R56
SYMATTR Value 0
SYMBOL res 5712 2336 R90
WINDOW 0 0 56 VBottom 2
WINDOW 3 32 56 VTop 2
SYMATTR InstName R57
SYMATTR Value 6.8k
SYMBOL res 5856 2336 R90
WINDOW 0 0 56 VBottom 2
WINDOW 3 32 56 VTop 2
SYMATTR InstName R58
SYMATTR Value 0
SYMBOL OpAmps\\ADTL084 7232 1744 R0
SYMATTR InstName U19
SYMBOL voltage 7232 1952 R180
WINDOW 123 0 0 Left 0
WINDOW 39 0 0 Left 0
SYMATTR InstName V38
SYMATTR Value 12
SYMBOL voltage 7232 1776 R180
WINDOW 123 0 0 Left 0
WINDOW 39 0 0 Left 0
SYMATTR InstName V39
SYMATTR Value 12
SYMBOL res 7312 1584 R90
WINDOW 0 0 56 VBottom 2
WINDOW 3 32 56 VTop 2
SYMATTR InstName R59
SYMATTR Value 27k
SYMBOL res 6768 1776 R90
WINDOW 0 0 56 VBottom 2
WINDOW 3 32 56 VTop 2
SYMATTR InstName R60
SYMATTR Value 6.8k
SYMBOL res 6912 1776 R90
WINDOW 0 0 56 VBottom 2
WINDOW 3 32 56 VTop 2
SYMATTR InstName R61
SYMATTR Value 20.2k
SYMBOL res 6768 1888 R90
WINDOW 0 0 56 VBottom 2
WINDOW 3 32 56 VTop 2
SYMATTR InstName R62
SYMATTR Value 6.8k
SYMBOL res 6912 1888 R90
WINDOW 0 0 56 VBottom 2
WINDOW 3 32 56 VTop 2
SYMATTR InstName R63
SYMATTR Value 20.2k
SYMBOL res 6768 2016 R90
WINDOW 0 0 56 VBottom 2
WINDOW 3 32 56 VTop 2
SYMATTR InstName R64
SYMATTR Value 6.8k
SYMBOL res 6912 2016 R90
WINDOW 0 0 56 VBottom 2
WINDOW 3 32 56 VTop 2
SYMATTR InstName R65
SYMATTR Value 20.2k
SYMBOL res 6768 2128 R90
WINDOW 0 0 56 VBottom 2
WINDOW 3 32 56 VTop 2
SYMATTR InstName R66
SYMATTR Value 6.8k
SYMBOL res 6912 2128 R90
WINDOW 0 0 56 VBottom 2
WINDOW 3 32 56 VTop 2
SYMATTR InstName R67
SYMATTR Value 20.2k
SYMBOL res 6768 2256 R90
WINDOW 0 0 56 VBottom 2
WINDOW 3 32 56 VTop 2
SYMATTR InstName R68
SYMATTR Value 6.8k
SYMBOL res 6912 2256 R90
WINDOW 0 0 56 VBottom 2
WINDOW 3 32 56 VTop 2
SYMATTR InstName R69
SYMATTR Value 20.2k
SYMBOL res 6768 2368 R90
WINDOW 0 0 56 VBottom 2
WINDOW 3 32 56 VTop 2
SYMATTR InstName R70
SYMATTR Value 6.8k
SYMBOL res 6912 2368 R90
WINDOW 0 0 56 VBottom 2
WINDOW 3 32 56 VTop 2
SYMATTR InstName R71
SYMATTR Value 20.2k
TEXT -1312 384 Left 2 !.ac dec 1000 20 20k
TEXT -552 -120 Left 2 ;63hz 0 octavas
TEXT 720 -120 Left 2 ;63hz 1 octavas
TEXT -520 1360 Left 2 ;63hz 2 octavas
TEXT -520 1952 Left 2 ;160hz 2 octavas
TEXT 824 1328 Left 2 ;400hz 2 octavas
TEXT 760 1920 Left 2 ;1khz 2 octavas
TEXT 2152 1296 Left 2 ;2.5khz 2 octavas
TEXT 2152 1928 Left 2 ;6.3khz 2 octavas

The netlist it stands for:
* Ecualizador.asc
X§U1 N014 N002 N006 N018 N002 ADTL084  ; pins In+ In- V+ V- OUT
C1 N014 0 0.047µ
C2 N002 N013 0.1µ
R1 N014 N013 30k
R2 N013 V1 47k
V1 V1 0 AC 1
V2 0 N018 12
V3 N006 0 12
X§U2 N010 Vout6dB N004 N016 Vout6dB ADTL084  ; pins In+ In- V+ V- OUT
C3 N009 N002 0.1µ
C4 N010 N009 0.1µ
R3 Vout6dB N009 18k
R4 0 N010 36k
V5 0 N016 12
V6 N004 0 12
X§U3 N012 N001 N005 N017 N001 ADTL084  ; pins In+ In- V+ V- OUT
C5 N012 0 0.047µ
C6 N001 N011 0.1µ
R5 N012 N011 20k
R6 N011 V1 33k
V7 0 N017 12
V8 N005 0 12
X§U4 N008 Vout3dB N003 N015 Vout3dB ADTL084  ; pins In+ In- V+ V- OUT
C7 N007 N001 0.1µ
C8 N008 N007 0.1µ
R7 Vout3dB N007 24k
R8 0 N008 51k
V9 0 N015 12
V10 N003 0 12
X§U5 N044 N021 N029 N048 N021 ADTL084  ; pins In+ In- V+ V- OUT
C9 N044 0 0.047µ
C10 N021 N043 0.1µ
R9 N044 N043 15k
R10 N043 V1 24k
V4 0 N048 12
V11 N029 0 12
X§U6 N040 VoutB1 N026 N047 VoutB1 ADTL084  ; pins In+ In- V+ V- OUT
C11 N039 N021 1µ
C12 N040 N039 1µ
R11 VoutB1 N039 3.6k
R12 0 N040 7.5k
V12 0 N047 12
V13 N026 0 12
X§U7 N085 N063 N073 N092 N063 ADTL084  ; pins In+ In- V+ V- OUT
C13 N085 0 0.047µ
C14 N063 N084 0.1µ
R13 N085 N084 5.6k
R14 N084 V1 9.1k
V14 0 N092 12
V15 N073 0 12
X§U8 N079 VoutB2 N070 N089 VoutB2 ADTL084  ; pins In+ In- V+ V- OUT
C15 N078 N063 0.1µ
C16 N079 N078 0.1µ
R15 VoutB2 N078 15k
R16 0 N079 27k
V16 0 N089 12
V17 N070 0 12
X§U9 N036 N020 N025 N045 N020 ADTL084  ; pins In+ In- V+ V- OUT
C17 N036 0 0.0047µ
C18 N020 N035 0.01µ
R17 N036 N035 22k
R18 N035 V1 36k
V18 0 N045 12
V19 N025 0 12
X§U10 N031 VoutB3 N023 N041 VoutB3 ADTL084  ; pins In+ In- V+ V- OUT
C19 N030 N020 0.1µ
C20 N031 N030 0.1µ
R19 VoutB3 N030 5.6k
R20 0 N031 11k
V20 0 N041 12
V21 N023 0 12
X§U11 N081 N061 N071 N090 N061 ADTL084  ; pins In+ In- V+ V- OUT
C21 N081 0 0.0047µ
C22 N061 N080 0.01µ
R21 N081 N080 9.1k
R22 N080 V1 15k
V22 0 N090 12
V23 N071 0 12
X§U12 N077 VoutB4 N068 N086 VoutB4 ADTL084  ; pins In+ In- V+ V- OUT
C23 N076 N061 0.01µ
C24 N077 N076 0.01µ
R23 VoutB4 N076 22k
R24 0 N077 47k
V24 0 N086 12
V25 N068 0 12
X§U13 N033 N019 N024 N042 N019 ADTL084  ; pins In+ In- V+ V- OUT
C25 N033 0 470p
C26 N019 N032 0.001µ
R25 N033 N032 36k
R26 N032 V1 62k
V26 0 N042 12
V27 N024 0 12
X§U14 N028 VoutB5 N022 N037 VoutB5 ADTL084  ; pins In+ In- V+ V- OUT
C27 N027 N019 0.01µ
C28 N028 N027 0.01µ
R27 VoutB5 N027 9.1k
R28 0 N028 18k
V28 0 N037 12
V29 N022 0 12
X§U15 N088 N064 N074 N093 N064 ADTL084  ; pins In+ In- V+ V- OUT
C29 N088 0 470p
C30 N064 N087 0.001µ
R29 N088 N087 15k
R30 N087 V1 24k
V30 0 N093 12
V31 N074 0 12
X§U16 N083 VoutB6 N072 N091 VoutB6 ADTL084  ; pins In+ In- V+ V- OUT
C31 N082 N064 0.01µ
C32 N083 N082 0.01µ
R31 VoutB6 N082 3.6k
R32 0 N083 7.5k
V32 0 N091 12
V33 N072 0 12
X§U17 0 N034 N049 N055 VoutSum-12dB ADTL084  ; pins In+ In- V+ V- OUT
V34 0 N055 12
V35 N049 0 12
R33 VoutSum-12dB N034 27k
R34 N050 VoutB1 6.8k
R35 N034 N050 100k
R36 N057 VoutB2 6.8k
R37 N034 N057 100k
R38 N062 VoutB3 6.8k
R39 N034 N062 100k
R40 N067 VoutB4 6.8k
R41 N034 N067 100k
R42 N094 VoutB5 6.8k
R43 N034 N094 100k
R44 N097 VoutB6 6.8k
R45 N034 N097 100k
X§U18 0 N038 N051 N056 VoutSum+12dB ADTL084  ; pins In+ In- V+ V- OUT
V36 0 N056 12
V37 N051 0 12
R46 VoutSum+12dB N038 27k
R47 N052 VoutB1 6.8k
R48 N038 N052 0
R49 N059 VoutB2 6.8k
R50 N038 N059 0
R51 N065 VoutB3 6.8k
R52 N038 N065 0
R53 N069 VoutB4 6.8k
R54 N038 N069 0
R55 N095 VoutB5 6.8k
R56 N038 N095 0
R57 N098 VoutB6 6.8k
R58 N038 N098 0
X§U19 0 N046 N053 N058 VoutSum0dB ADTL084  ; pins In+ In- V+ V- OUT
V38 0 N058 12
V39 N053 0 12
R59 VoutSum0dB N046 27k
R60 N054 VoutB1 6.8k
R61 N046 N054 20.2k
R62 N060 VoutB2 6.8k
R63 N046 N060 20.2k
R64 N066 VoutB3 6.8k
R65 N046 N066 20.2k
R66 N075 VoutB4 6.8k
R67 N046 N075 20.2k
R68 N096 VoutB5 6.8k
R69 N046 N096 20.2k
R70 N099 VoutB6 6.8k
R71 N046 N099 20.2k
.ac dec 1000 20 20k
* 63hz 0 octavas
* 63hz 1 octavas
* 63hz 2 octavas
* 160hz 2 octavas
* 400hz 2 octavas
* 1khz 2 octavas
* 2.5khz 2 octavas
* 6.3khz 2 octavas
.lib ADTL084.lib
.backanno
.end